# Altium schematic sheet PLL Power.SchDoc
size A3
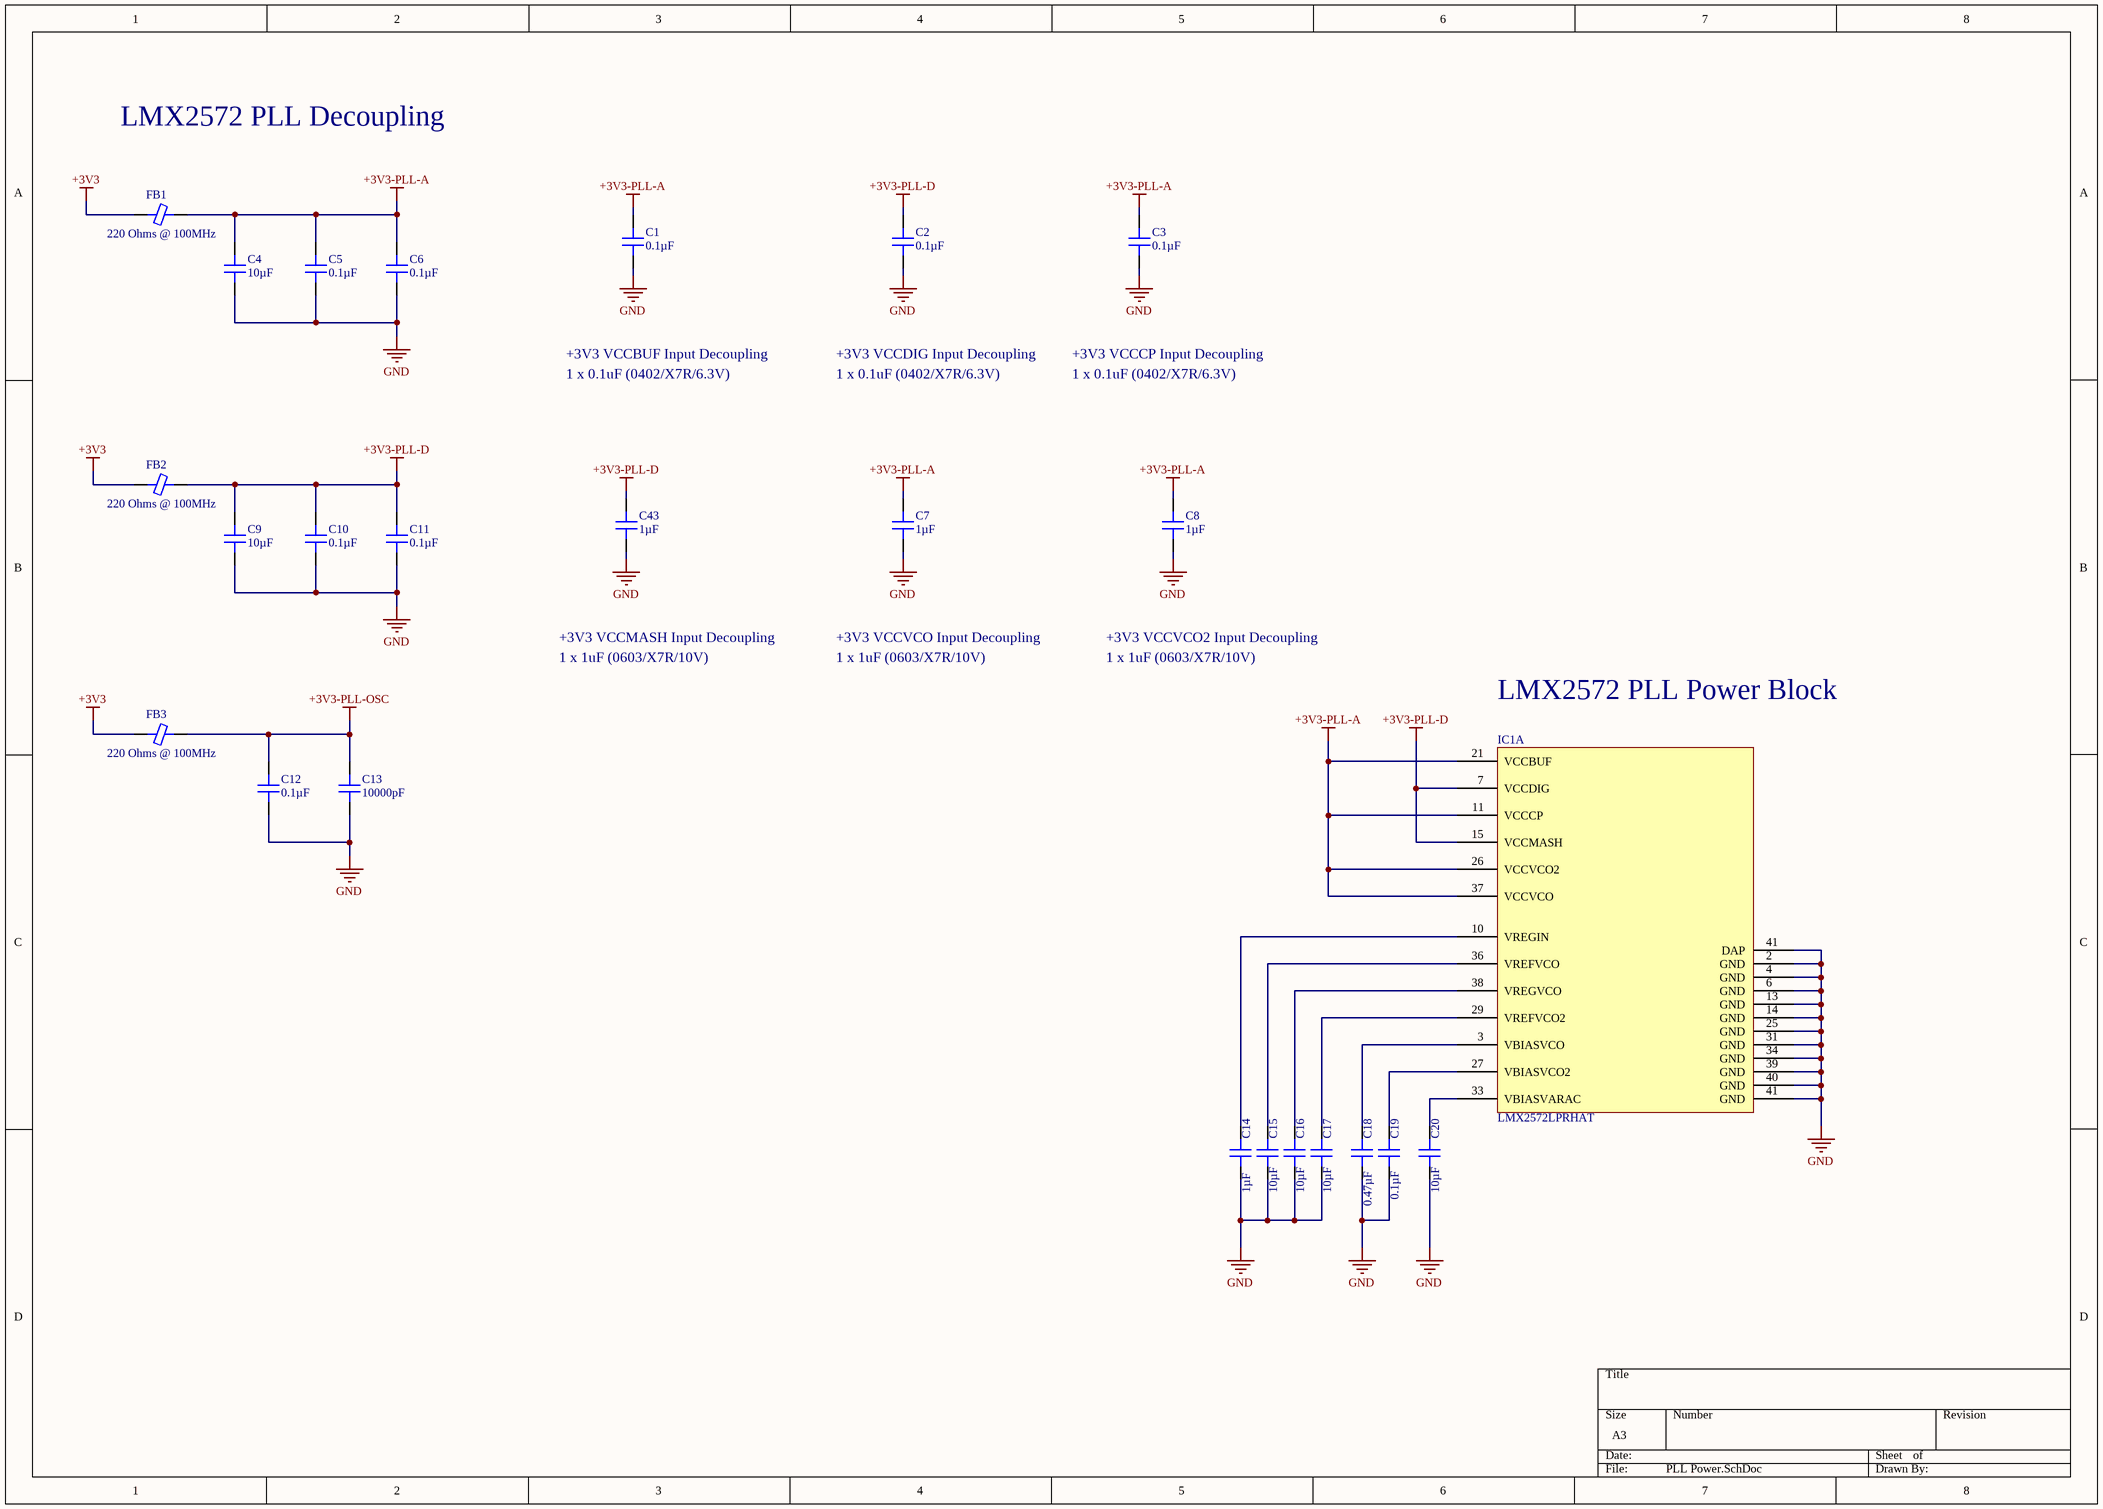
[diagram p0: PLL Power.SchDoc]

## Parts
C1  0.1µF  [CAP 0402_1005]
C2  0.1µF  [CAP 0402_1005]
C3  0.1µF  [CAP 0402_1005]
C4  10µF  [CAP 0805_2012]
C5  0.1µF  [CAP 0402_1005]
C6  0.1µF  [CAP 0402_1005]
C7  1µF  [CAP 0603_1608]
C8  1µF  [CAP 0603_1608]
C9  10µF  [CAP 0805_2012]
C10  0.1µF  [CAP 0402_1005]
C11  0.1µF  [CAP 0402_1005]
C12  0.1µF  [CAP 0402_1005]
C13  10000pF  [CAP 0402_1005]
C14  1µF  [CAP 0603_1608]
C15  10µF  [CAP 0805_2012]
C16  10µF  [CAP 0805_2012]
C17  10µF  [CAP 0805_2012]
C18  0.47µF  [CAP 0402_1005]
C19  0.1µF  [CAP 0402_1005]
C20  10µF  [CAP 0805_2012]
C43  1µF  [CAP 0603_1608]
FB1  220 Ohms @ 100MHz  [FER 0402_1005]
FB2  220 Ohms @ 100MHz  [FER 0402_1005]
FB3  220 Ohms @ 100MHz  [FER 0402_1005]
IC1  LMX2572LPRHAT  [TI VQFN-40 6X6MM]  (part A of 2)

## Nets
+3V3: FB1.2 FB2.2 FB3.2
+3V3-PLL-A: C1.2 C3.2 C4.2 C5.2 C6.2 C7.1 C8.1 FB1.1 IC1.11(VCCCP) IC1.21(VCCBUF) IC1.26(VCCVCO2) IC1.37(VCCVCO)
+3V3-PLL-D: C2.2 C9.2 C10.2 C11.2 C43.1 FB2.1 IC1.7(VCCDIG) IC1.15(VCCMASH)
+3V3-PLL-OSC: C12.2 C13.1 FB3.1
GND: C1.1 C2.1 C3.1 C4.1 C5.1 C6.1 C7.2 C8.2 C9.1 C10.1 C11.1 C12.1 C13.2 C14.2 C15.2 C16.2 C17.2 C18.1 C19.1 C20.2 C43.2 IC1.2(GND) IC1.4(GND) IC1.6(GND) IC1.13(GND) IC1.14(GND) IC1.25(GND) IC1.31(GND) IC1.34(GND) IC1.39(GND) IC1.40(GND) IC1.41(GND)
NetC14_1: C14.1 IC1.10(VREGIN)
NetC15_1: C15.1 IC1.36(VREFVCO)
NetC16_1: C16.1 IC1.38(VREGVCO)
NetC17_1: C17.1 IC1.29(VREFVCO2)
NetC18_2: C18.2 IC1.3(VBIASVCO)
NetC19_2: C19.2 IC1.27(VBIASVCO2)
NetC20_1: C20.1 IC1.33(VBIASVARAC)

## Notes on the sheet
- LMX2572 PLL Decoupling
- +3V3 VCCBUF Input Decoupling
- 1 x 0.1uF (0402/X7R/6.3V)
- +3V3 VCCDIG Input Decoupling
- +3V3 VCCCP Input Decoupling
- +3V3 VCCMASH Input Decoupling
- +3V3 VCCVCO Input Decoupling
- +3V3 VCCVCO2 Input Decoupling
- 1 x 1uF (0603/X7R/10V)
- LMX2572 PLL Power Block

## Library data of the parts
C1-C3 C5 C6 C10-C12 C19 = 0402B104K6R3CT: CAP CER 0.1UF 6.3V X7R 0402; Manufacturer: Walsin Technology Corporation; Tolerance: ±10%; Part Number: 0402B104K6R3CT; Applications: General Purpose; Capacitance: 0.1µF; ComponentLink1Description: Datasheet; ComponentLink1URL: http://www.passivecomponent.com/wp-content/uploads/2018/10/MLCC.pdf; ComponentLink2Description: DigiKey Link; ComponentLink2URL: http://digikey.com/product-detail/en/walsin-technology-corporation/0402B104K6R3CT/1292-1177-1-ND/9355181; Device Package: 0402 (1005 Metric); LastUpdated: 2020-02-03 5:04:43 PM; Lifecycle Status: Active; Minimum Order: 1; Mounting Type: Surface Mount, MLCC; Operating Temperature: -55°C ~ 125°C; Package / Case: 0402 (1005 Metric); Packaging: CutTape; Part Status: Active; Price: 0.10; Series: -; Size / Dimension: 0.039" L x 0.020" W (1.00mm x 0.50mm); Supplier 1: DigiKey; Supplier Part Number 1: 1292-1177-1-ND; Temperature Coefficient: X7R; Thickness (Max): 0.022" (0.55mm); Value: 0.1µF; Voltage - Rated: 6.3V
C4 C9 C15-C17 C20 = 08056D106KAT4A: CAP CER 10UF 6.3V X5R 0805; Manufacturer: AVX Corporation; Tolerance: ±10%; Part Number: 08056D106KAT4A; Applications: General Purpose; Capacitance: 10µF; ComponentLink1Description: Datasheet; ComponentLink1URL: http://datasheets.avx.com/cx5r.pdf; ComponentLink2Description: DigiKey Link; ComponentLink2URL: http://digikey.com/product-detail/en/avx-corporation/08056D106KAT4A/478-10692-1-ND/7536564; Device Package: 0805 (2012 Metric); LastUpdated: 2020-02-03 5:06:37 PM; Lifecycle Status: Active; Minimum Order: 1; Mounting Type: Surface Mount, MLCC; Operating Temperature: -55°C ~ 85°C; Package / Case: 0805 (2012 Metric); Packaging: TapeAndReel; Part Status: Active; Price: 0.17; Series: -; Size / Dimension: 0.079" L x 0.049" W (2.01mm x 1.25mm); Supplier 1: DigiKey; Supplier Part Number 1: 478-10692-1-ND; Temperature Coefficient: X5R; Thickness (Max): 0.060" (1.52mm); Value: 10µF; Voltage - Rated: 6.3V
C7 C8 C14 C43 = C0603C105K8RACTU: CAP CER 1UF 10V X7R 0603; Manufacturer: KEMET; Tolerance: ±10%; Part Number: C0603C105K8RACTU; Applications: Bypass, Decoupling; Capacitance: 1µF; ComponentLink1Description: Datasheet; ComponentLink1URL: https://api.kemet.com/component-edge/download/datasheet/C0603C105K8RACTU.pdf; ComponentLink2Description: DigiKey Link; ComponentLink2URL: http://digikey.com/product-detail/en/kemet/C0603C105K8RACTU/399-11133-1-ND/4357815; Device Package: 0603 (1608 Metric); LastUpdated: 2020-02-03 5:05:31 PM; Lifecycle Status: Active; Minimum Order: 1; Mounting Type: Surface Mount, MLCC; Operating Temperature: -55°C ~ 125°C; Package / Case: 0603 (1608 Metric); Packaging: TapeAndReel; Part Status: Active; Price: 0.01; Series: SMD Comm X7R; Size / Dimension: 0.063" L x 0.031" W (1.60mm x 0.80mm); Supplier 1: DigiKey; Supplier Part Number 1: 399-11133-1-ND; Temperature Coefficient: X7R; Thickness (Max): 0.035" (0.90mm); Value: 1µF; Voltage - Rated: 10V
C13 = EMF105B7103KVHF: CAP, MLCC, 0402/1005, 16V, X7R,; Manufacturer: Taiyo Yuden; Tolerance: ±10%; Part Number: EMF105B7103KVHF; Applications: Automotive, SMPS Filtering; Capacitance: 10000pF; ComponentLink1Description: Datasheet; ComponentLink1URL: https://ds.yuden.co.jp/TYCOMPAS/ut/detail?pn=EMF105B7103KVHF&u=M; ComponentLink2Description: DigiKey Link; ComponentLink2URL: http://digikey.com/product-detail/en/taiyo-yuden/EMF105B7103KVHF/587-6583-1-ND/10379276; Device Package: 0402 (1005 Metric); LastUpdated: 2020-02-03 5:03:46 PM; Lifecycle Status: Active; Minimum Order: 1; Mounting Type: Surface Mount, MLCC; Operating Temperature: -55°C ~ 125°C; Package / Case: 0402 (1005 Metric); Packaging: TapeAndReel; Part Status: Active; Price: 0.01; Ratings: AEC-Q200; Series: M; Size / Dimension: 0.039" L x 0.020" W (1.00mm x 0.50mm); Supplier 1: DigiKey; Supplier Part Number 1: 587-6583-1-ND; Temperature Coefficient: X7R; Thickness (Max): 0.022" (0.55mm); Value: 10000pF; Voltage - Rated: 16V
C18 = 0402B474K100CT: CAP CER 0.47UF 10V X7R 0402; Manufacturer: Walsin Technology Corporation; Tolerance: ±10%; Part Number: 0402B474K100CT; Applications: General Purpose; Capacitance: 0.47µF; ComponentLink1Description: Datasheet; ComponentLink1URL: http://www.passivecomponent.com/wp-content/uploads/2018/10/MLCC.pdf; ComponentLink2Description: DigiKey Link; ComponentLink2URL: http://digikey.com/product-detail/en/walsin-technology-corporation/0402B474K100CT/1292-1218-1-ND/9355222; Device Package: 0402 (1005 Metric); LastUpdated: 2020-02-03 5:04:14 PM; Lifecycle Status: Active; Minimum Order: 1; Mounting Type: Surface Mount, MLCC; Operating Temperature: -55°C ~ 125°C; Package / Case: 0402 (1005 Metric); Packaging: TapeAndReel; Part Status: Active; Price: 0.07; Series: -; Size / Dimension: 0.039" L x 0.020" W (1.00mm x 0.50mm); Supplier 1: DigiKey; Supplier Part Number 1: 1292-1218-1-ND; Temperature Coefficient: X7R; Thickness (Max): 0.022" (0.55mm); Value: 0.47µF; Voltage - Rated: 10V
FB1-FB3 = BBPY00100505221Y00: EMI BEAD FILETER; Manufacturer: Chilisin Electronics; Current Rating (Max): 1.1A; Number of Lines: 1; Part Number: BBPY00100505221Y00; ComponentLink1Description: Datasheet; ComponentLink1URL: https://www.chilisin.com/upload/media/product/emi_bead/file/BBPY_Series.pdf; ComponentLink2Description: DigiKey Link; ComponentLink2URL: http://digikey.com/product-detail/en/chilisin-electronics/BBPY00100505221Y00/2184-BBPY00100505221Y00CT-ND/10509222; Device Package: 0402 (1005 Metric); Height (Max): 0.024" (0.60mm); Impedance @ Frequency: 220 Ohms @ 100MHz; LastUpdated: 2020-02-03 5:15:17 PM; Lifecycle Status: Active; Minimum Order: 1; Mounting Type: Surface Mount; Operating Temperature: -55°C ~ 125°C; Package / Case: 0402 (1005 Metric); Packaging: Unknown; Part Status: Active; Price: 0.01; Series: *; Size / Dimension: 0.039" L x 0.020" W (1.00mm x 0.50mm); Supplier 1: DigiKey; Supplier Part Number 1: 2184-BBPY00100505221Y00CT-ND; Value: 220 Ohms @ 100MHz
IC1 = LMX2572LPRHAT: IC FREQUENCY SYNTH 40VQFN; Manufacturer: Texas Instruments; Frequency - Max: 2GHz; Differential - Input:Output: Yes/Yes; Ratio - Input:Output: 1:2; PLL: Yes; Voltage - Supply: 3 ~ 3.5V; Part Number: LMX2572LPRHAT; ComponentLink1Description: Datasheet; ComponentLink1URL: http://www.ti.com/general/docs/suppproductinfo.tsp?distId=10&gotoUrl=http%3A%2F%2Fwww.ti.com%2Flit%2Fgpn%2Flmx2572lp; ComponentLink2Description: DigiKey Link; ComponentLink2URL: https://www.digikey.com/en/products/detail/texas-instruments/LMX2572LPRHAT/9593375; Device Package: Tape & Reel; Output: -; Driver/Multiplier: Yes/Yes; LastUpdated: 2021-02-16 1:51:24 AM; Lifecycle Status: Active; Minimum Order: 1; Mounting Type: Surface Mount; Part Status: 1; Price: 13.52; Supplier 1: DigiKey; Supplier Part Number 1: 296-51375-2-ND